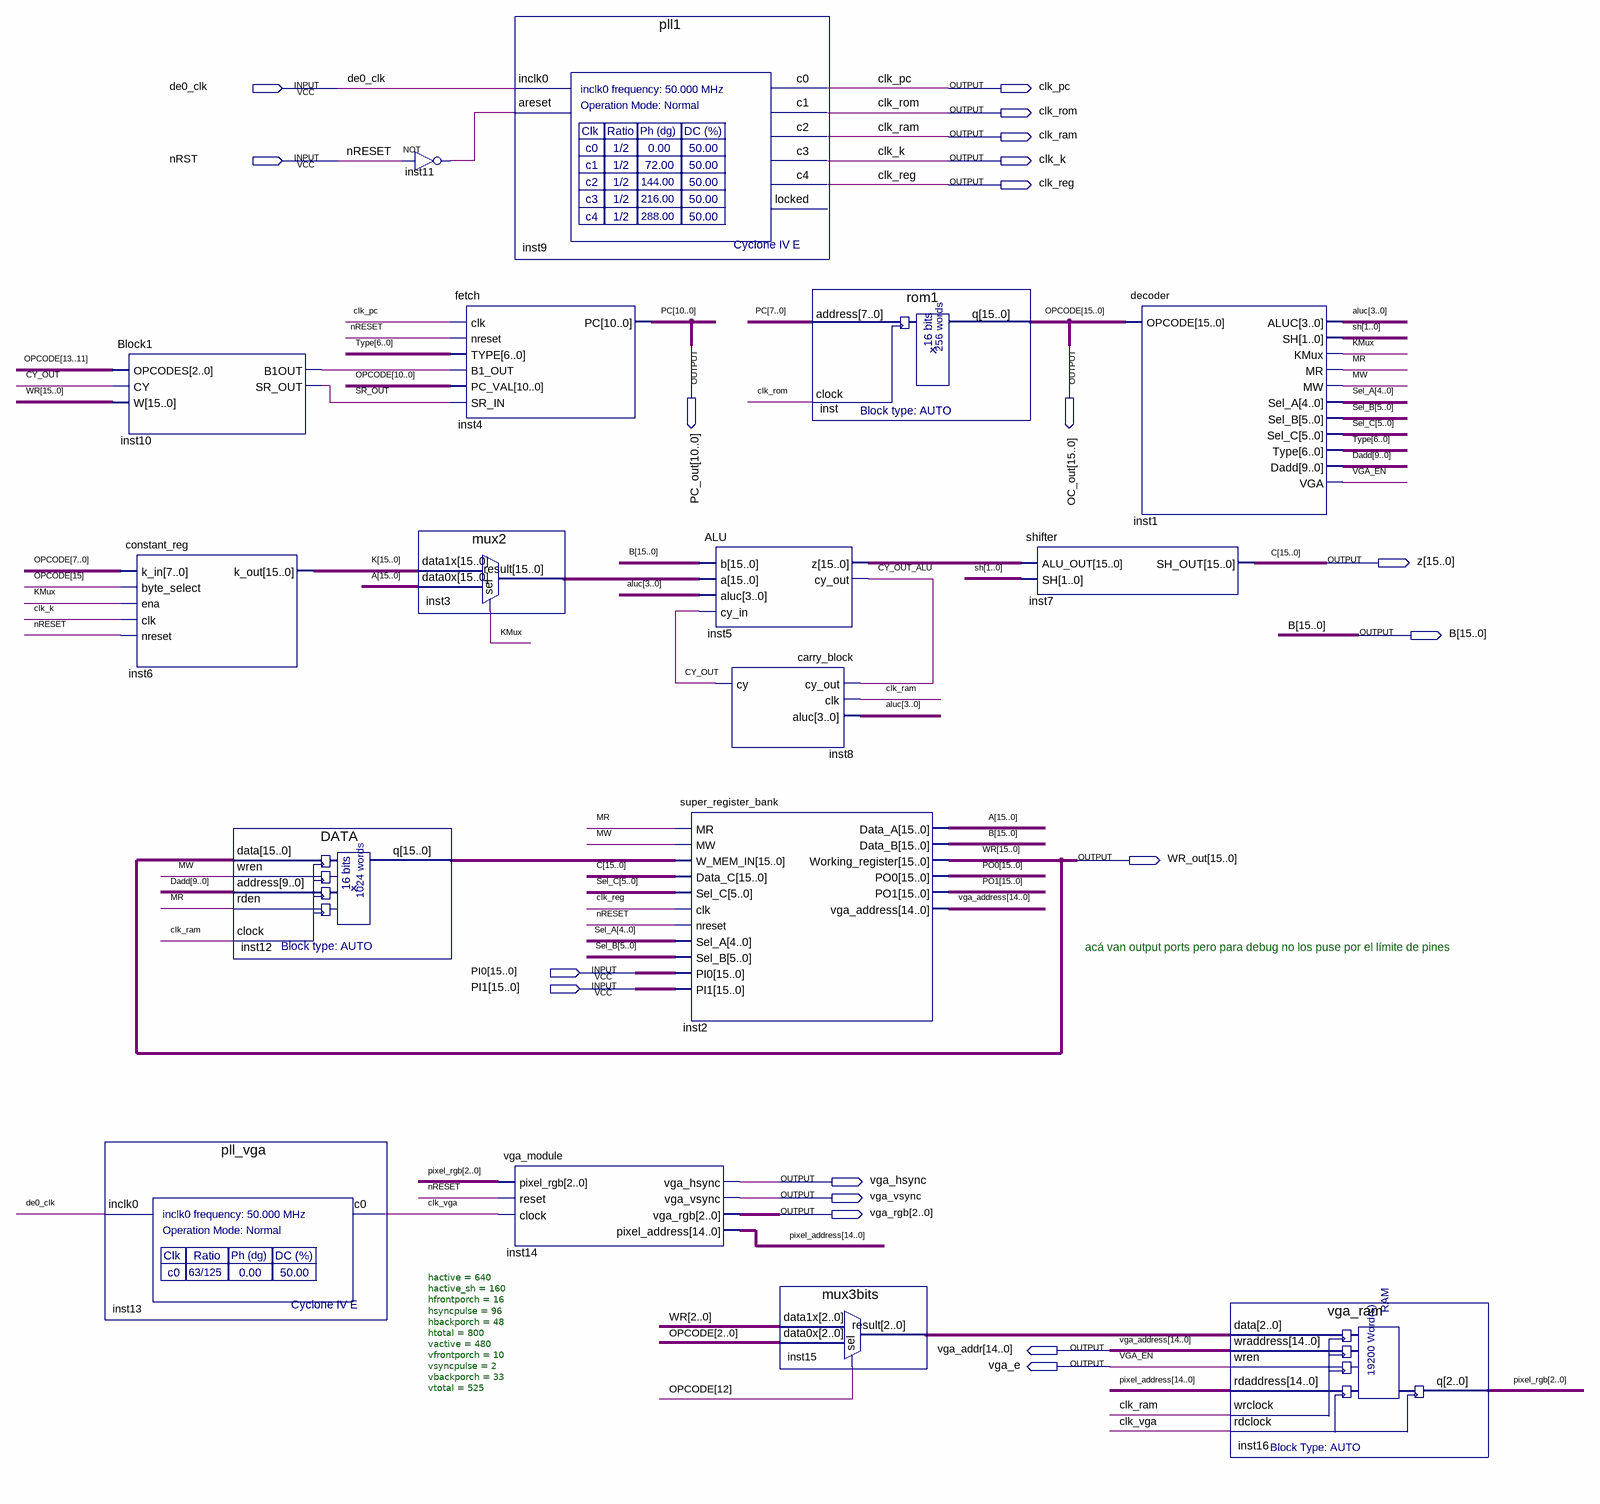
[diagram p0: schematic sheet]
// Quartus schematic uc1.bdf as structural Verilog: 17 symbols, 19 pins
module uc1 (
  input  de0_clk,
  input  nRST,
  input  [15:0] PI0,
  input  [15:0] PI1,
  output clk_pc,
  output clk_rom,
  output clk_ram,
  output clk_k,
  output clk_reg,
  output [10:0] PC_out,
  output [15:0] OC_out,
  output [15:0] z,
  output [15:0] B,
  output [15:0] WR_out,
  output vga_hsync,
  output vga_vsync,
  output [2:0] vga_rgb,
  output [14:0] vga_addr,
  output vga_e
);

  wire clk_vga, CY_OUT, CY_OUT_ALU, inst10_b1out, inst11_out, KMux, MR, MW, SR_OUT;
  wire [1:0] sh;
  wire [2:0] inst15_result, pixel_rgb;
  wire [3:0] aluc;
  wire [4:0] Sel_A;
  wire [5:0] Sel_B, Sel_C;
  wire [6:0] Type;
  wire [9:0] Dadd;
  wire [14:0] pixel_address;
  wire [15:0] A, inst3_result, inst5_z, inst12_q, K, PO0, PO1;

  Block1 inst10 (.OPCODES(OC_out[13:11]), .CY(CY_OUT), .W(WR_out), .B1OUT(inst10_b1out), .SR_OUT(SR_OUT));
  constant_reg inst6 (.k_in(OC_out[7:0]), .byte_select(OC_out[15]), .ena(KMux), .clk(clk_k), .nreset(nRST), .k_out(K));
  pll_vga inst13 (.inclk0(de0_clk), .c0(clk_vga));
  DATA inst12 (.data(WR_out), .wren(MW), .address(Dadd), .rden(MR), .clock(clk_ram), .q(inst12_q));
  not inst11 (inst11_out, nRST);
  fetch inst4 (
    .clk(clk_pc), .nreset(nRST), .TYPE(Type), .B1_OUT(inst10_b1out), .PC_VAL(OC_out[10:0]), .SR_IN(SR_OUT),
    .PC(PC_out));
  mux2 inst3 (.data1x(K), .data0x(A), .sel(KMux), .result(inst3_result));
  pll1 inst9 (
    .inclk0(de0_clk), .areset(inst11_out), .c0(clk_pc), .c1(clk_rom), .c2(clk_ram), .c3(clk_k), .c4(clk_reg));  // open: locked
  vga_module #(.hactive(640), .hactive_sh(160), .hfrontporch(16), .hsyncpulse(96), .hbackporch(48), .htotal(800), .vactive(480), .vfrontporch(10), .vsyncpulse(2), .vbackporch(33), .vtotal(525)) inst14 (
    .pixel_rgb(pixel_rgb), .reset(nRST), .clock(clk_vga), .vga_hsync(vga_hsync), .vga_vsync(vga_vsync),
    .vga_rgb(vga_rgb), .pixel_address(pixel_address));
  ALU inst5 (.b(B), .a(inst3_result), .aluc(aluc), .cy_in(CY_OUT), .z(inst5_z), .cy_out(CY_OUT_ALU));
  super_register_bank inst2 (
    .MR(MR), .MW(MW), .W_MEM_IN(inst12_q), .Data_C(z), .Sel_C(Sel_C), .clk(clk_reg), .nreset(nRST),
    .Sel_A(Sel_A), .Sel_B(Sel_B), .PI0(PI0), .PI1(PI1), .Data_A(A), .Data_B(B), .Working_register(WR_out),
    .PO0(PO0), .PO1(PO1), .vga_address(vga_addr));
  carry_block inst8 (.cy_out(CY_OUT_ALU), .clk(clk_ram), .aluc(aluc), .cy(CY_OUT));
  rom1 inst (.address(PC_out[7:0]), .clock(clk_rom), .q(OC_out));
  mux3bits inst15 (.data1x(WR_out[2:0]), .data0x(OC_out[2:0]), .sel(OC_out[12]), .result(inst15_result));
  shifter inst7 (.ALU_OUT(inst5_z), .SH(sh), .SH_OUT(z));
  decoder inst1 (
    .OPCODE(OC_out), .ALUC(aluc), .SH(sh), .KMux(KMux), .MR(MR), .MW(MW), .Sel_A(Sel_A), .Sel_B(Sel_B),
    .Sel_C(Sel_C), .Type(Type), .Dadd(Dadd), .VGA(vga_e));
  vga_ram inst16 (
    .data(inst15_result), .wraddress(vga_addr), .wren(vga_e), .rdaddress(pixel_address), .wrclock(clk_ram),
    .rdclock(clk_vga), .q(pixel_rgb));

  // Other names for the same wires on the sheet: C[15:0] = z; nRESET = nRST; OPCODE[15:0] = OC_out; PC[10:0] = PC_out;
  //   vga_address[14:0] = vga_addr; VGA_EN = vga_e; WR[15:0] = WR_out

  // Notes on the sheet:
  //   acá van output ports pero para debug no los puse por el límite de pines
endmodule
